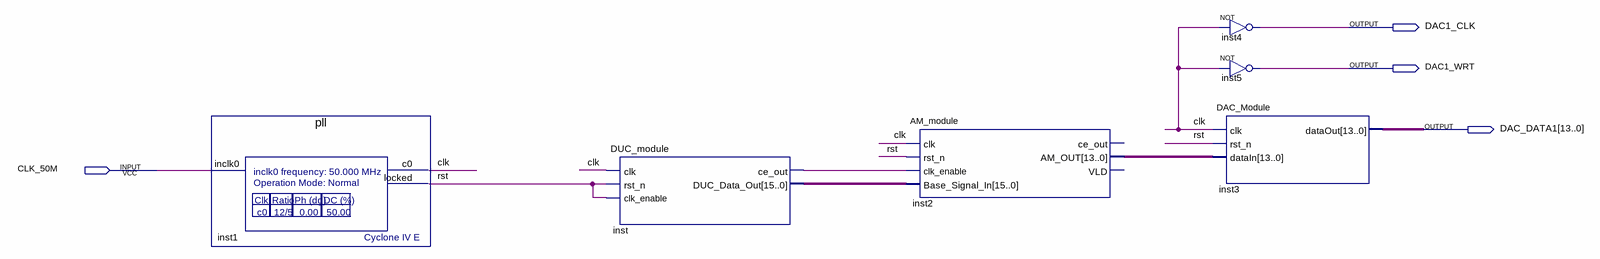
[diagram p0: schematic sheet]
// Quartus schematic DUC_AM.bdf as structural Verilog: 6 symbols, 4 pins
module DUC_AM (
  input  CLK_50M,
  output DAC1_CLK,
  output DAC1_WRT,
  output [13:0] DAC_DATA1
);

  wire clk, inst_ce_out, rst;
  wire [13:0] inst2_am_out;
  wire [15:0] inst_duc_data_out;

  pll inst1 (.inclk0(CLK_50M), .c0(clk), .locked(rst));
  DUC_module inst (.clk(clk), .rst_n(rst), .clk_enable(rst), .ce_out(inst_ce_out), .DUC_Data_Out(inst_duc_data_out));
  AM_module inst2 (
    .clk(clk), .rst_n(rst), .clk_enable(inst_ce_out), .Base_Signal_In(inst_duc_data_out),
    .AM_OUT(inst2_am_out));  // open: ce_out, VLD
  not inst4 (DAC1_CLK, clk);
  not inst5 (DAC1_WRT, clk);
  DAC_Module inst3 (.clk(clk), .rst_n(rst), .dataIn(inst2_am_out), .dataOut(DAC_DATA1));
endmodule
